# EAGLE design 5MMLedBreakoutForArduino (EAGLE 6.5.0)
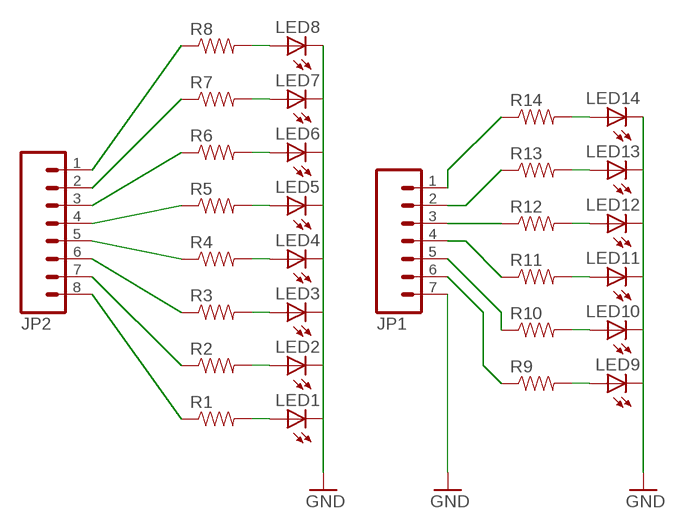
[diagram p0: schematic, sheet 1]

## Parts
JP1  M07  [1X07]
JP2  M081X08  [1X08]
LED1  LED5MM  [LED5MM]
LED2  LED5MM  [LED5MM]
LED3  LED5MM  [LED5MM]
LED4  LED5MM  [LED5MM]
LED5  LED5MM  [LED5MM]
LED6  LED5MM  [LED5MM]
LED7  LED5MM  [LED5MM]
LED8  LED5MM  [LED5MM]
LED9  LED5MM  [LED5MM]
LED10  LED5MM  [LED5MM]
LED11  LED5MM  [LED5MM]
LED12  LED5MM  [LED5MM]
LED13  LED5MM  [LED5MM]
LED14  LED5MM  [LED5MM]
R1  RESISTORAXIAL-0.3  [AXIAL-0.3]
R2  RESISTORAXIAL-0.3  [AXIAL-0.3]
R3  RESISTORAXIAL-0.3  [AXIAL-0.3]
R4  RESISTORAXIAL-0.3  [AXIAL-0.3]
R5  RESISTORAXIAL-0.3  [AXIAL-0.3]
R6  RESISTORAXIAL-0.3  [AXIAL-0.3]
R7  RESISTORAXIAL-0.3  [AXIAL-0.3]
R8  RESISTORAXIAL-0.3  [AXIAL-0.3]
R9  RESISTORAXIAL-0.3  [AXIAL-0.3]
R10  RESISTORAXIAL-0.3  [AXIAL-0.3]
R11  RESISTORAXIAL-0.3  [AXIAL-0.3]
R12  RESISTORAXIAL-0.3  [AXIAL-0.3]
R13  RESISTORAXIAL-0.3  [AXIAL-0.3]
R14  RESISTORAXIAL-0.3  [AXIAL-0.3]

## Nets
GND: JP1.7 LED1.K(C) LED2.K(C) LED3.K(C) LED4.K(C) LED5.K(C) LED6.K(C) LED7.K(C) LED8.K(C) LED9.K(C) LED10.K(C) LED11.K(C) LED12.K(C) LED13.K(C) LED14.K(C)
N$1: LED1.A R1.P$2
N$2: LED2.A R2.P$2
N$3: LED3.A R3.P$2
N$4: LED4.A R4.P$2
N$5: LED5.A R5.P$2
N$6: LED6.A R6.P$2
N$7: LED7.A R7.P$2
N$8: LED8.A R8.P$2
N$9: LED9.A R9.P$2
N$10: LED10.A R10.P$2
N$11: LED11.A R11.P$2
N$12: LED12.A R12.P$2
N$13: LED13.A R13.P$2
N$14: LED14.A R14.P$2
N$15: JP1.1 R14.P$1
N$16: JP1.2 R13.P$1
N$17: JP1.3 R12.P$1
N$18: JP1.4 R11.P$1
N$19: JP1.5 R10.P$1
N$20: JP1.6 R9.P$1
N$21: JP2.1 R8.P$1
N$22: JP2.2 R7.P$1
N$23: JP2.3 R6.P$1
N$24: JP2.4 R5.P$1
N$25: JP2.5 R4.P$1
N$26: JP2.6 R3.P$1
N$27: JP2.7 R2.P$1
N$28: JP2.8 R1.P$1

## Library data of the parts
JP1 = SparkFun-Connectors:M07: Header 7 Standard 7-pin 0.1" header. Use with straight break away headers (SKU : PRT-00116), right angle break away headers (PRT-00553), swiss pins (PRT-00743), machine pins (PRT-00117), and female headers (PRT-00115). NOTES ON THE VARIANTS LOCK and LOCK_LONGPADS... This footprint was designed to help hold the alignment of a through-hole component (i.e. 7-pin header) while soldering it into place. You may notice that each hole has been shifted either up or down by 0.005 of an inch from it's more standard position (which is usually a perfectly straight line). This slight alteration caused the pins (the squares in the middle) to touch the edges of the holes. Because they are alternating, it causes a "brace" to hold the header in place. 0.005 has proven to be the perfect amount of "off-center" position when using our standard breakaway headers. Although looks a little odd when you look at the bare footprint, once you have a header in there, the alteration is very hard to notice. Also, if you push a header all the way into place, it is covered up entirely on the bottom side. This idea of altering the position of holes to aid alignment will be further integrated into the Sparkfun Library for other footprints. It can help hold any component with 3 or more connection pins.
JP2 = SparkFun-Connectors:M08: Header 8 Standard 8-pin 0.1" header. Use with straight break away headers (SKU : PRT-00116), right angle break away headers (PRT-00553), swiss pins (PRT-00743), machine pins (PRT-00117), and female headers (PRT-00115).
LED1-LED14 = barbary_enterprises:LED: LEDs Standard schematic elements and footprints for 5mm, 3mm, 1206, and 0603 sized LEDs. 5mm - Spark Fun Electronics SKU : COM-00529 (and others)
R1-R14 = barbary_enterprises:RESISTOR: Resistor Basic schematic elements and footprints for 0603, 1206, and PTH resistors.

## Board
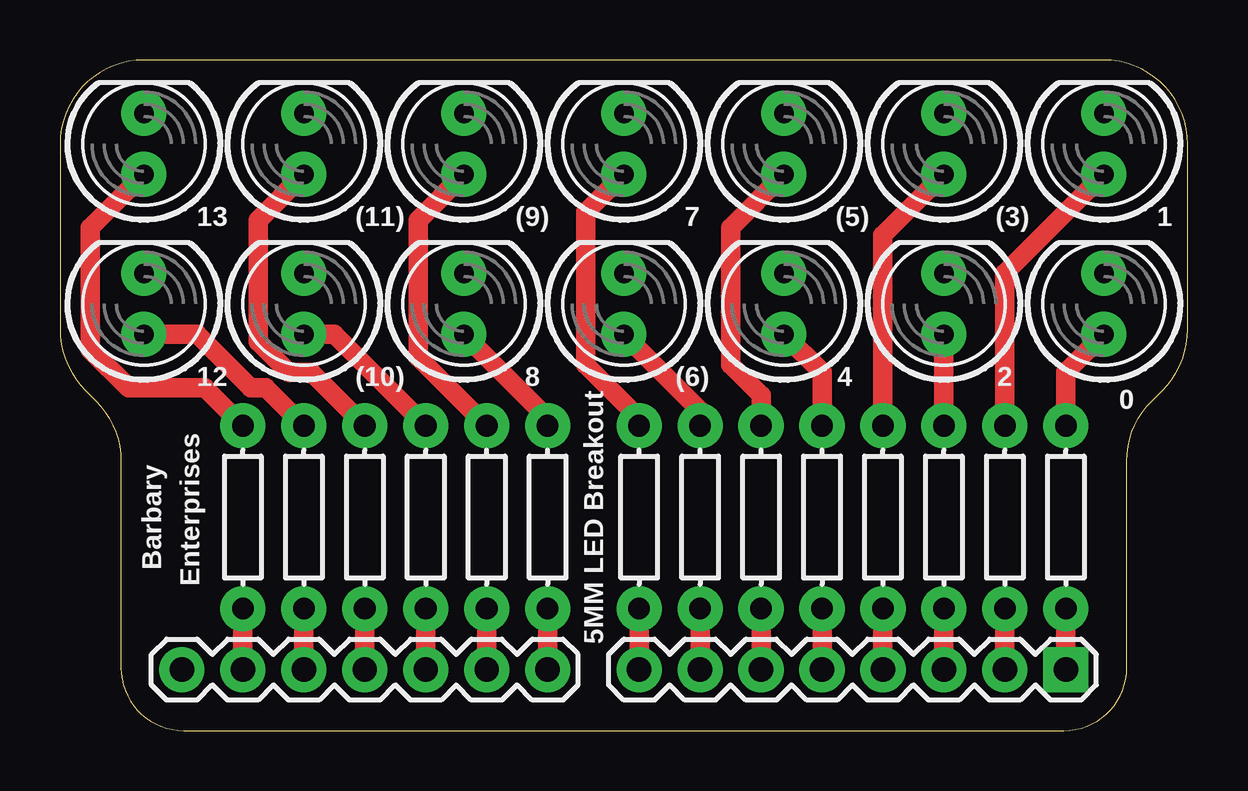
[diagram p1: board, top side]
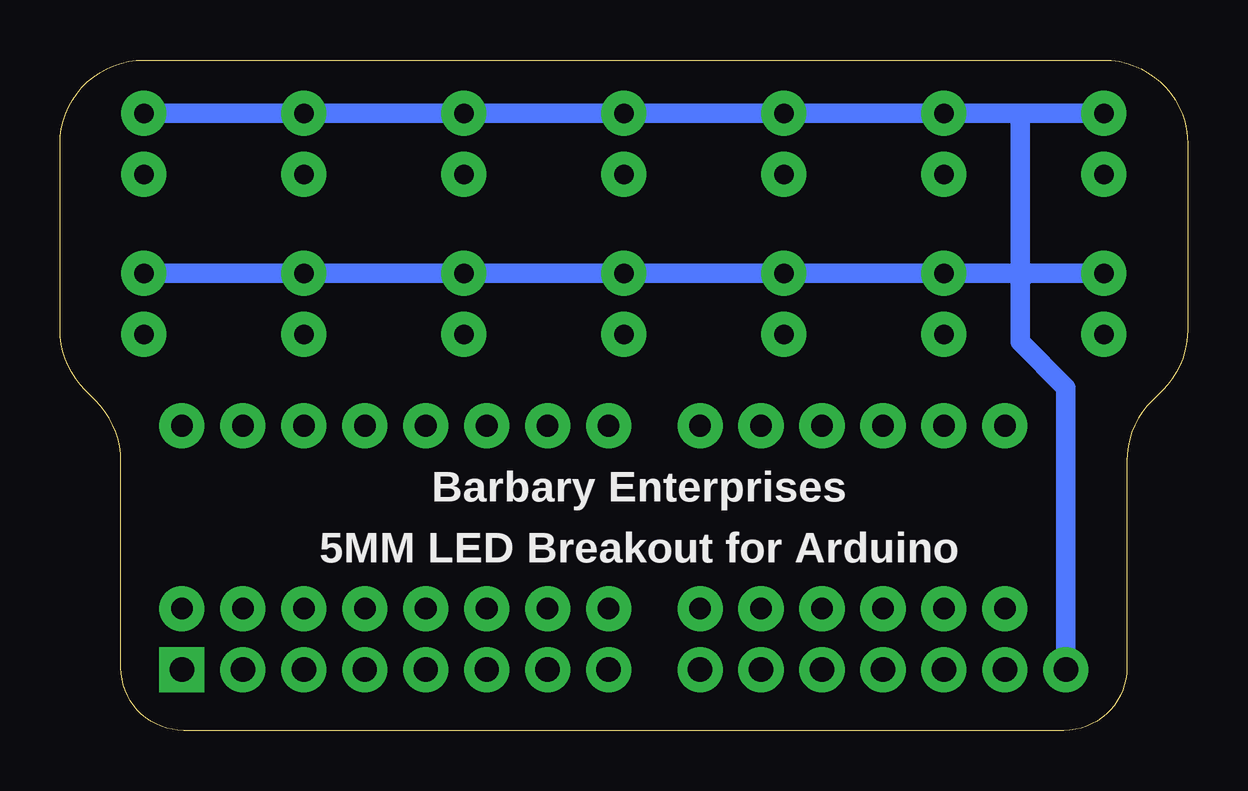
[diagram p2: board, bottom side, seen from below]

Size 46.99 x 27.94 mm. Coordinates in mm from the lower left corner, seen from the top.
Outline: 1.05,14.19 1.49,13.75 arc-45 2.54,11.21 2.54,2.62 arc90 5.16,0 41.83,0 arc90 44.45,2.62 44.45,11.21 arc-45 45.5,13.75 45.94,14.19 arc45 46.99,16.73 46.99,24.43 arc90 43.48,27.94 3.51,27.94 arc90 0,24.43 0,16.73 arc45 1.05,14.19
Copper layers (1*16): Top 0.0356mm / dielectric 1.5011mm / Bottom 0.0356mm
Design rules "LaenPCBOrder": minimum track width 6mil, minimum drill 13mil, track to track 6mil, track to pad 6mil, pad to pad 6mil, via to via 6mil, smd to smd 6mil, copper to edge 15mil, drill to drill 6mil, minimum pad ring 7mil, minimum via ring 7mil, stop-mask expansion 3mil, vias tented up to drill 0mil, thermal gap 10mil

### Footprints (pad centres in the part's own frame; a part is rotated, then mirrored left to right if it is on the bottom)
1X07 = drill 1.016 pad 1.88: 1 0,0; 2 2.54,0; 3 5.08,0; 4 7.62,0; 5 10.16,0; 6 12.7,0; 7 15.24,0
1X08 = drill 1.016 pad 1.88 square: 1 0,0 | drill 1.016 pad 1.88: 2 2.54,0; 3 5.08,0; 4 7.62,0; 5 10.16,0; 6 12.7,0; 7 15.24,0; 8 17.78,0
LED5MM = drill 0.813 pad 1.88: A -1.27,0; K 1.27,0
AXIAL-0.3 = drill 0.9 pad 1.88: P$1 -3.81,0; P$2 3.81,0

### Placement (x,y rotation side)
JP1  20.32,2.54 180 top
JP2  41.91,2.54 180 top
LED1  23.5,24.45 90 top
LED2  23.5,17.78 90 top
LED3  30.16,24.45 90 top
LED4  30.16,17.78 90 top
LED5  36.83,24.45 90 top
LED6  36.83,17.78 90 top
LED7  43.5,24.45 90 top
LED8  43.5,17.78 90 top
LED9  3.49,24.45 90 top
LED10  3.49,17.78 90 top
LED11  10.16,24.45 90 top
LED12  10.16,17.78 90 top
LED13  16.83,24.45 90 top
LED14  16.83,17.78 90 top
R1  24.13,8.89 90 top
R2  26.67,8.89 90 top
R3  29.21,8.89 90 top
R4  31.75,8.89 90 top
R5  34.29,8.89 90 top
R6  36.83,8.89 90 top
R7  39.37,8.89 90 top
R8  41.91,8.89 90 top
R9  7.62,8.89 90 top
R10  10.16,8.89 90 top
R11  12.7,8.89 90 top
R12  15.24,8.89 90 top
R13  17.78,8.89 90 top
R14  20.32,8.89 90 top

### Tracks (layer width: path | path; a pad name or v marks a point on that pad's centre or on a via)
GND
  Bottom 0.813: LED7.K LED5.K LED3.K LED1.K LED13.K LED11.K 6.99,25.72 | LED8.K LED6.K LED4.K LED2.K LED14.K LED12.K 6.99,19.05 | 6.99,19.05 6.67,19.05 | 6.67,19.05 LED10.K | JP1.7 5.08,14.29 6.99,16.19 6.99,18.73 6.67,19.05 | LED9.K 6.99,25.72 | 6.99,25.72 6.99,19.05
N$1
  Top 0.813: R1.P$2 24.13,13.02 21.91,15.24 21.91,21.59 LED1.A
N$2
  Top 0.813: R2.P$2 26.67,13.34 LED2.A
N$3
  Top 0.813: R3.P$2 29.21,13.97 27.94,15.24 27.94,20.95 LED3.A
N$4
  Top 0.813: R4.P$2 31.75,14.92 LED4.A
N$5
  Top 0.813: R5.P$2 34.29,20.64 LED5.A
N$6
  Top 0.813: R6.P$2 LED6.A
N$7
  Top 0.813: R7.P$2 39.37,19.05 LED7.A
N$8
  Top 0.813: R8.P$2 41.91,14.92 LED8.A
N$9
  Top 0.813: R9.P$2 6.03,14.29 2.86,14.29 1.27,15.88 1.27,20.95 LED9.A
N$10
  Top 0.813: R10.P$2 8.57,14.29 7.94,14.29 5.71,16.51 LED10.A
N$11
  Top 0.813: R11.P$2 10.48,14.92 9.53,14.92 8.26,16.19 8.26,21.27 LED11.A
N$12
  Top 0.813: R12.P$2 11.43,16.51 LED12.A
N$13
  Top 0.813: R13.P$2 14.92,15.56 14.92,21.27 LED13.A
N$14
  Top 0.813: R14.P$2 20.32,13.02 LED14.A
N$15
  Top 0.813: JP1.1 R14.P$1
N$16
  Top 0.813: JP1.2 R13.P$1
N$17
  Top 0.813: JP1.3 R12.P$1
N$18
  Top 0.813: JP1.4 R11.P$1
N$19
  Top 0.813: JP1.5 R10.P$1
N$20
  Top 0.813: JP1.6 R9.P$1
N$21
  Top 0.813: JP2.1 R8.P$1
N$22
  Top 0.813: JP2.2 R7.P$1
N$23
  Top 0.813: JP2.3 R6.P$1
N$24
  Top 0.813: JP2.4 R5.P$1
N$25
  Top 0.813: JP2.5 R4.P$1
N$26
  Top 0.813: JP2.6 R3.P$1
N$27
  Top 0.813: JP2.7 R2.P$1
N$28
  Top 0.813: JP2.8 R1.P$1

### Text on the board
tPlace: 13 | (11) | (9) | 7 | (5) | (3) | 1 | 12 | (10) | 8 | (6) | 4 | 2 | 0 | Barbary | Enterprises | 5MM LED Breakout
bPlace: Barbary Enterprises | 5MM LED Breakout for Arduino